# Altium project UHF RFID reder.PrjPcb (part 1 of 2)
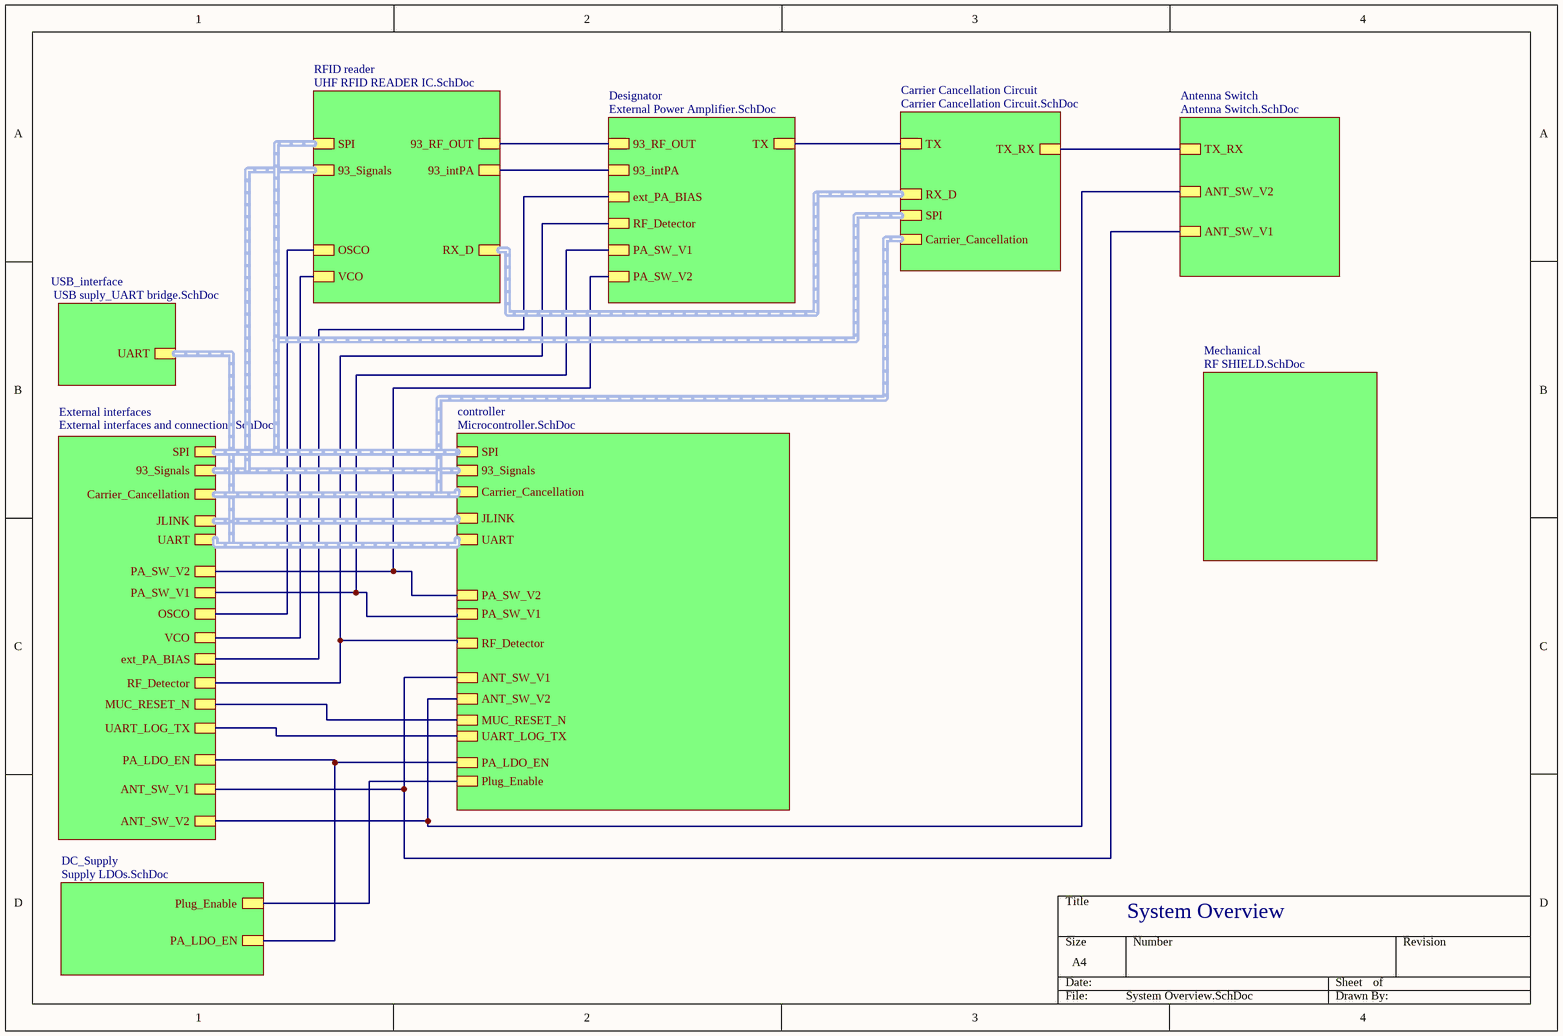
[diagram p0: System Overview.SchDoc]
10 sheets, 305 parts. Net scope: hierarchical (ports join the sheet entries above them; power ports are global).
Board file: UHF_RFID_PROJECT.PcbDoc
Sheets:
  System Overview.SchDoc
    RFID reader = UHF RFID READER IC.SchDoc
    Designator = External Power Amplifier.SchDoc
    Antenna Switch = Antenna Switch.SchDoc
    Carrier Cancellation Circuit = Carrier Cancellation Circuit.SchDoc
    USB_interface = USB suply_UART bridge.SchDoc
    External interfaces = External interfaces and connections.SchDoc
    controller = Microcontroller.SchDoc
    DC_Supply = Supply LDOs.SchDoc
    Mechanical = RF SHIELD.SchDoc

## Sheet System Overview.SchDoc
size A4; SheetNumber: 1; SheetTotal: 10

### Sub-sheets
Antenna Switch = Antenna Switch.SchDoc: TX_RX, ANT_SW_V2, ANT_SW_V1
Carrier Cancellation Circuit = Carrier Cancellation Circuit.SchDoc: TX, TX_RX, RX_D (harness RX_D), SPI (harness SPI), Carrier_Cancellation (harness Carrier_Cancellation)
controller = Microcontroller.SchDoc: JLINK (harness JLINK), UART (harness UART), PA_SW_V2, PA_SW_V1, RF_Detector, ANT_SW_V2, ANT_SW_V1, MUC_RESET_N, PA_LDO_EN, SPI (harness SPI), 93_Signals (harness 93_Signals), Carrier_Cancellation (harness Carrier_Cancellation), UART_LOG_TX, Plug_Enable
DC_Supply = Supply LDOs.SchDoc: Plug_Enable, PA_LDO_EN
Designator = External Power Amplifier.SchDoc: TX, 93_RF_OUT, 93_intPA, ext_PA_BIAS, RF_Detector, PA_SW_V1, PA_SW_V2
External interfaces = External interfaces and connections.SchDoc: PA_SW_V2, PA_SW_V1, OSCO, VCO, ext_PA_BIAS, RF_Detector, MUC_RESET_N, UART_LOG_TX, PA_LDO_EN, ANT_SW_V1, ANT_SW_V2, SPI (harness SPI), 93_Signals (harness 93_Signals), Carrier_Cancellation (harness Carrier_Cancellation), JLINK (harness JLINK), UART (harness UART)
Mechanical = RF SHIELD.SchDoc: no entries
RFID reader = UHF RFID READER IC.SchDoc: 93_RF_OUT, OSCO, VCO, 93_intPA, SPI (harness SPI), 93_Signals (harness 93_Signals), RX_D (harness RX_D)
USB_interface = USB suply_UART bridge.SchDoc: UART (harness UART)

### Nets
Detector: sheet Designator/RF_Detector, sheet External interfaces/RF_Detector, sheet controller/RF_Detector
OSCO: sheet RFID reader/OSCO, sheet External interfaces/OSCO
PA_LDO_EN: sheet External interfaces/PA_LDO_EN, sheet controller/PA_LDO_EN, sheet DC_Supply/PA_LDO_EN
UART_LOG_TX: sheet External interfaces/UART_LOG_TX, sheet controller/UART_LOG_TX
NetB1_1: sheet External interfaces/MUC_RESET_N, sheet controller/MUC_RESET_N
NetC55_2: sheet RFID reader/VCO, sheet External interfaces/VCO
NetC107_2: sheet RFID reader/93_intPA, sheet Designator/93_intPA
NetC112_2: sheet Antenna Switch/TX_RX, sheet Carrier Cancellation Circuit/TX_RX
NetJ1_A: sheet RFID reader/93_RF_OUT, sheet Designator/93_RF_OUT
NetJ14_3: sheet controller/Plug_Enable, sheet DC_Supply/Plug_Enable
NetJ30_1: sheet Designator/PA_SW_V1, sheet External interfaces/PA_SW_V1, sheet controller/PA_SW_V1
NetJ30_2: sheet Designator/PA_SW_V2, sheet External interfaces/PA_SW_V2, sheet controller/PA_SW_V2
NetJ31_1: sheet Antenna Switch/ANT_SW_V1, sheet External interfaces/ANT_SW_V1, sheet controller/ANT_SW_V1
NetJ31_2: sheet Antenna Switch/ANT_SW_V2, sheet External interfaces/ANT_SW_V2, sheet controller/ANT_SW_V2
NetR21_2: sheet Designator/ext_PA_BIAS, sheet External interfaces/ext_PA_BIAS
NetT2_1: sheet Designator/TX, sheet Carrier Cancellation Circuit/TX

### Buses and harness runs
harness sheet Carrier Cancellation Circuit/Carrier_Cancellation = sheet controller/Carrier_Cancellation = sheet External interfaces/Carrier_Cancellation
harness sheet Carrier Cancellation Circuit/RX_D = sheet RFID reader/RX_D
harness sheet Carrier Cancellation Circuit/SPI = sheet controller/SPI = sheet External interfaces/SPI = sheet RFID reader/SPI
harness sheet controller/93_Signals = sheet External interfaces/93_Signals = sheet RFID reader/93_Signals
harness sheet controller/JLINK = sheet External interfaces/JLINK
harness sheet controller/UART = sheet External interfaces/UART = sheet USB_interface/UART

### Notes on the sheet
- System Overview

## Sheet UHF RFID READER IC.SchDoc
size A4; SheetNumber: 2; SheetTotal: 10
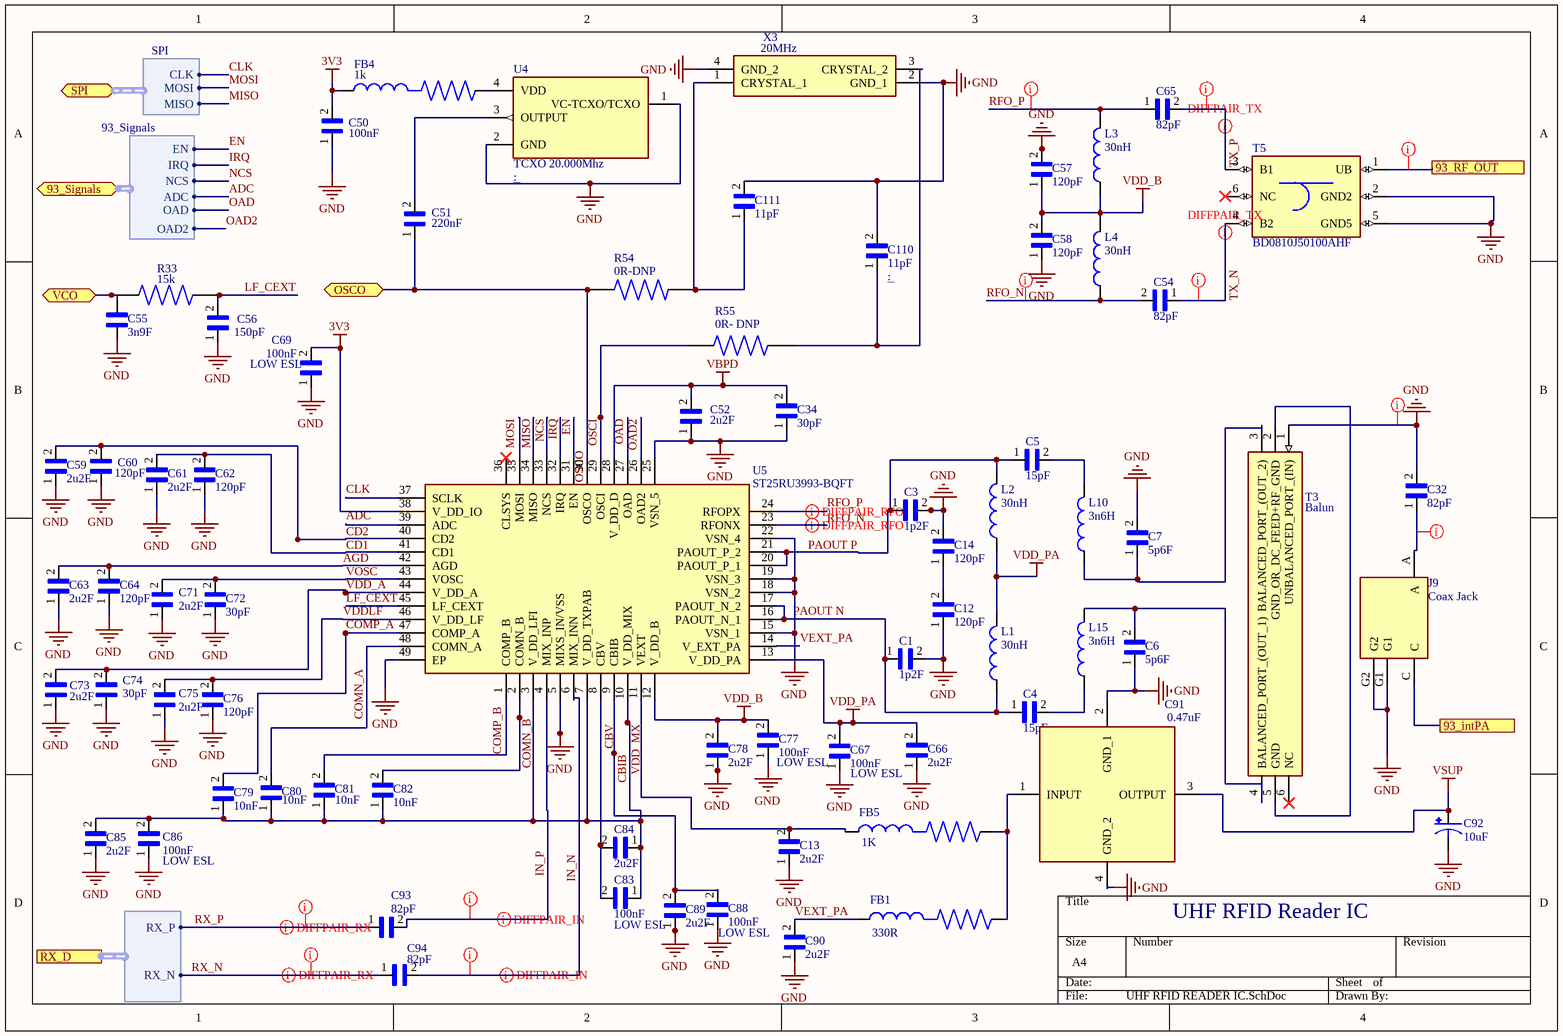
[diagram p1: UHF RFID READER IC.SchDoc]

### Parts
C1  1p2F  [CAPC1005X55N]
C3  1p2F  [CAPC1005X55N]
C4  15pF  [CAPC1005X55N]
C5  15pF  [CAPC1005X55N]
C6  5p6F  [CAPC1005X55N]
C7  5p6F  [CAPC1005X55N]
C12  120pF  [CAPC0603X33N]
C13  2u2F  [CAPC0603X35N]
C14  120pF  [CAPC0603X33N]
C32  82pF  [CAPC1005X55N]
C34  30pF  [CAPC0603X33N]
C50  100nF  [CAPC1005X55N]
C51  220nF  [CAPC1005X55N]
C52  2u2F  [CAPC0603X35N]
C54  82pF  [CAPC1005X55N]
C55  3n9F  [CAPC1005X55N]
C56  150pF  [CAPC1005X55N]
C57  120pF  [CAPC0603X33N]
C58  120pF  [CAPC0603X33N]
C59  2u2F  [CAPC0603X35N]
C60  120pF  [CAPC0603X33N]
C61  2u2F  [CAPC0603X35N]
C62  120pF  [CAPC0603X33N]
C63  2u2F  [CAPC0603X35N]
C64  120pF  [CAPC0603X33N]
C65  82pF  [CAPC1005X55N]
C66  2u2F  [CAPC0603X35N]
C67  100nF  [CAPC0510X35N]
C69  100nF  [CAPC0510X35N]
C71  2u2F  [CAPC0603X35N]
C72  30pF  [CAPC0603X33N]
C73  2u2F  [CAPC0603X35N]
C74  30pF  [CAPC0603X33N]
C75  2u2F  [CAPC0603X35N]
C76  120pF  [CAPC0603X33N]
C77  100nF  [CAPC0510X35N]
C78  2u2F  [CAPC0603X35N]
C79  10nF  [CAPC0603X33N]
C80  10nF  [CAPC0603X33N]
C81  10nF  [CAPC0603X33N]
C82  10nF  [CAPC0603X33N]
C83  100nF  [CAPC0510X35N]
C84  2u2F  [CAPC0603X35N]
C85  2u2F  [CAPC0603X35N]
C86  100nF  [CAPC0510X35N]
C88  100nF  [CAPC0510X35N]
C89  2u2F  [CAPC0603X35N]
C90  2u2F  [CAPC0603X35N]
C91  0.47uF  [NFM18CC101R1C3D]
C92  10uF  [2917(POL)]
C93  82pF  [CAPC1005X55N]
C94  82pF  [CAPC1005X55N]
C110  11pF  [CAPC1005X55N]
C111  11pF  [CAPC1005X55N]
FB1  330R  [BEADC1005X55N]
FB4  1k  [BEADC1005X55N]
FB5  1K  [BEADC1005X55N]
J9  Coax Jack  [SW_MS-156HF(01)]
L1  30nH  [INDC1005X60N]
L2  30nH  [INDC1005X60N]
L3  30nH  [INDC1005X60N]
L4  30nH  [INDC1005X60N]
L10  3n6H  [INDC1006X60N]
L15  3n6H  [INDC1006X60N]
R33  15k  [RES_ERJ-2GEJ153X]
R54  0R-DNP  [RESC1607X60N]
R55  0R- DNP  [RESC1607X60N]
T3  Balun  [0900BL15C050E]
T5  BD0810J50100AHF  [BD0810J50100AHF]
U4  TCXO 20.000Mhz  [OSCCC320X250X100N]
U5  ST25RU3993-BQFT  [FP-ST25RU3993-BQFT-IPC_A]
X3  20MHz  [NX3225SA20000000MHZB2]

### Ports
93_intPA (see System Overview[2A], External Power Amplifier[3A]), 93_RF_OUT (see System Overview[2A], External Power Amplifier[1B]), 93_Signals (bidir, harness 93_Signals, see System Overview[1A], External interfaces and connections[1B], Microcontroller[4A]), OSCO (bidir, see System Overview[1A], External interfaces and connections[4C]), RX_D (harness RX_D, see System Overview[2A], Carrier Cancellation Circuit[3B]), SPI (bidir, harness SPI, see System Overview[1A], Carrier Cancellation Circuit[1A], External interfaces and connections[1A], Microcontroller[4A]), VCO (bidir, see System Overview[1B], External interfaces and connections[4C])

### Harnesses
SPI: CLK, MISO, MOSI
93_Signals: EN, IRQ, NCS, ADC, OAD, OAD2
RX_D: RX_P, RX_N

### Nets
3V3: C50.2 C69.2 FB4.1 U5.38(V_DD_IO)
GND: C1.2 C3.2 C6.1 C7.2 C12.1 C13.1 C14.2 C32.2 C34.1 C50.1 C52.1 C55.1 C56.1 C57.2 C58.1 C59.1 C60.1 C61.1 C62.1 C63.1 C64.1 C66.1 C67.1 C69.1 C71.1 C72.1 C73.1 C74.1 C75.1 C76.1 C77.1 C78.1 C85.1 C86.1 C88.1 C89.1 C90.1 C91.2(GND_1) C91.4(GND_2) C92.2(NEG) C110.2 C111.2 J9.G1 J9.G2 T3.1(UNBALANCED_PORT_(IN)) T5.2(GND2) T5.5(GND5) U4.1(VC-TCXO/TCXO) U4.2(GND) U5.5(MIXS_IN/VSS) U5.15(VSN_1) U5.18(VSN_2) U5.19(VSN_3) U5.22(VSN_4) U5.25(VSN_5) U5.49(EP) X3.2(GND_1) X3.4(GND_2)
VBPD: C34.2 C52.2 U5.28(V_DD_D)
VDD_B: C57.1 C58.2 C77.2 C78.2 L3.1 L4.2 U5.12(V_DD_B)
VDD_PA: C66.2 C67.2 L1.2 L2.1 U5.13(V_DD_PA)
VSUP: C91.3(OUTPUT) C92.1(POS)
ADC: U5.39(ADC) ; port 93_Signals.ADC
AGD: C63.2 C64.2 U5.42(AGD)
CBIB: C88.2 C89.2 U5.9(CBIB)
CBV: C83.2 C84.2 U5.8(CBV)
CD1: C61.2 C62.2 U5.41(CD1)
CD2: C59.2 C60.2 U5.40(CD2)
CLK: U5.37(SCLK) ; port SPI.CLK
COMN_A: C80.2 U5.48(COMN_A)
COMN_B: C82.2 U5.2(COMN_B)
COMP_A: C79.2 U5.47(COMP_A)
COMP_B: C81.2 U5.1(COMP_B)
EN: U5.31(EN) ; port 93_Signals.EN
IN_N: C94.2 U5.6(MIX_INN)
IN_P: C93.2 U5.4(MIX_INP)
IRQ: U5.32(IRQ) ; port 93_Signals.IRQ
LF_CEXT: C56.2 R33.2 U5.45(LF_CEXT)
MISO: U5.34(MISO) ; port SPI.MISO
MOSI: U5.35(MOSI) ; port SPI.MOSI
NCS: U5.33(NCS) ; port 93_Signals.NCS
OAD: U5.27(OAD) ; port 93_Signals.OAD
OAD2: U5.26(OAD2) ; port 93_Signals.OAD2
OSCI: R55.1 U5.29(OSCI)
OSCO: C51.1 R54.1 U5.30(OSCO) ; port OSCO
PAOUT N: C1.1 C4.1 L1.1 U5.16(PAOUT_N_1) U5.17(PAOUT_N_2)
PAOUT P: C3.1 C5.1 L2.2 U5.20(PAOUT_P_1) U5.21(PAOUT_P_2)
RFO_N: C54.2 L4.1 U5.23(RFONX)
RFO_P: C65.1 L3.2 U5.24(RFOPX)
RX_N: C94.1 ; port RX_D.RX_N
RX_P: C93.1 ; port RX_D.RX_P
TX_N: C54.1 T5.4(B2)
TX_P: C65.2 T5.3(B1)
VDD_A: C73.2 C74.2 U5.44(V_DD_A)
VDD_MX: C79.1 C80.1 C81.1 C82.1 C83.1 C84.1 C85.2 C86.2 U5.3(V_DD_LFI) U5.7(V_DD_TXPAB) U5.10(V_DD_MIX)
VDDLF: C75.2 C76.2 U5.46(V_DD_LF)
VEXT_PA: C90.2 FB1.1 U5.14(V_EXT_PA)
VOSC: C71.2 C72.2 U5.43(VOSC)
NetC4_2: C4.2 L15.1
NetC5_2: C5.2 L10.2
NetC6_2: C6.2 L15.2 T3.4(BALANCED_PORT_(OUT_1))
NetC7_1: C7.1 L10.1 T3.3(BALANCED_PORT_(OUT_2))
NetC12_2: C12.2 C14.1
NetC13_2: C13.2 FB5.1 U5.11(VEXT)
NetC32_1: C32.1 J9.A
NetC51_2: C51.2 U4.3(OUTPUT)
NetC55_2: C55.2 R33.1 ; port VCO
NetC91_1: C91.1(INPUT) FB1.2 FB5.2
NetC107_2: J9.C ; port 93_intPA
NetC110_1: C110.1 R55.2 X3.3(CRYSTAL_2)
NetC111_1: C111.1 R54.2 X3.1(CRYSTAL_1)
NetFB4_2: FB4.2 U4.4(VDD)
NetJ1_A: T5.1(UB) ; port 93_RF_OUT
NetT3_2: T3.2(GND_OR_DC_FEED+RF_GND) T3.5(GND)

Not connected (* = marked no-connect by the designer): T3 6(NC)*; T5 6(NC)*; U5 36(CLSYS)*

### Layout directives
differential pair; differential pair class RFO: RFO_N, RFO_P
differential pair; differential pair class TX: TX_N, TX_P
differential pair; differential pair class RX: RX_N, RX_P
differential pair; differential pair class IN: IN_N, IN_P
net class RF_100: IN_N, IN_P, RFO_N, RFO_P, RX_N, RX_P, TX_N, TX_P
net class RF_50: GND, NetC32_1, NetJ1_A

### Notes on the sheet
- (near C69) LOW ESL
- LOW ESL
- (near C67) LOW ESL
- (near C86) LOW ESL
- (near C91) UHF RFID Reader IC
- (near C88) LOW ESL

### Library data of the parts
C1 C3 = GRM1555C1H1R2WA01D: SMD Capacitor C0G_EIA_ with Capacitance: 1.2pF Tol. 0.05pF. Rated Voltage: 50Vdc; MF: Murata Electronics; MP: GRM1555C1H1R2WA01D; Availability: Unavailable; Package: 1005 Taiyo Yuden; Value: *; Price: None; SnapEDA_Link: https://www.snapeda.com/parts/GRM1555C1H1R2WA01D/Murata%20Electronics%20North%20America/view-part/1837628/?ref=snap
C4 C5 = GRM1555C1H150GA01D: 0402 15 pF 50 V Â±2% Tolerance C0G SMT Multilayer Ceramic Capacitor; Package: None; Price: None; Value: *; MP: GRM1555C1H150GA01D; Availability: Unavailable
C6 C7 = GJM1555C1H5R6CB01D: SMD Capacitor C0G(EIA) with Capacitance: 5.6pF Tol. 0.25pF. Rated Voltage: 50Vdc; MF: Murata; Purchase-URL: https://pricing.snapeda.com/search/part/GJM1555C1H5R6CB01D/?ref=eda; SnapEDA_Link: https://www.snapeda.com/parts/GJM1555C1H5R6CB01D/Murata/view-part/4376987/?ref=snap; Value: *; MP: GJM1555C1H5R6CB01D; Check_prices: https://www.snapeda.com/parts/GJM1555C1H5R6CB01D/Murata/view-part/4376987/?ref=eda; Package: 1005 Taiyo Yuden; Availability: Good; Price: None
C12 C14 C57 C58 C60 C62 C64 C76 = GRM0335C1H121JA01D: 0201 120 pF 50 V Â±5% Tolerance C0G SMT Multilayer Ceramic Capacitor; MF: Murata Electronics; Check_prices: https://www.snapeda.com/parts/GRM0335C1H121JA01D/Murata%20Electronics%20North%20America/view-part/1767262/?ref=eda; Value: *; Purchase-URL: https://pricing.snapeda.com/search/part/GRM0335C1H121JA01D/?ref=eda; Package: 0603 Taiyo Yuden; Price: None; MP: GRM0335C1H121JA01D; Availability: In Stock; SnapEDA_Link: https://www.snapeda.com/parts/GRM0335C1H121JA01D/Murata%20Electronics%20North%20America/view-part/1767262/?ref=snap
C13 C52 C59 C61 C63 C66 C71 C73 C75 C78 C84 C85 C89 C90 = GRM033R60J225ME15D: SMD Capacitor X5R(EIA) with Capacitance: 2.2uF Tol. 20%. Rated Voltage: 6.3Vdc; Package: None; Price: None; Value: *; MP: GRM033R60J225ME15D; Availability: Unavailable
C32 C54 C65 C93 C94 = GRM1555C1H820GA01J: CAP CER 82PF 50V C0G/NP0 0402; Package: None; Price: None; Value: *; MP: GRM1555C1H820GA01J; Availability: Unavailable
C34 C72 C74 = GRM0335C1H300GA01D: SMD Capacitor C0G(EIA) with Capacitance: 30pF Tol. 2%. Rated Voltage: 50Vdc; Package: None; Price: None; Value: *; MP: GRM0335C1H300GA01D; Availability: Unavailable
C50 = GRM155R71C104KA88D: SMD Capacitor X7R_EIA_ with Capacitance: 0.10uF Tol. 10%. Rated Voltage: 16Vdc; MF: Murata; Package: 1005 Taiyo Yuden; Value: *; MP: GRM155R71C104KA88D; SnapEDA_Link: https://www.snapeda.com/parts/GRM155R71C104KA88D/Murata%20Electronics%20North%20America/view-part/4750/?ref=snap
C51 = GRM155R6YA224KE01D: CAP CER 0.22UF 35V X5R 0402; Package: None; Price: None; Value: *; MP: GRM155R6YA224KE01D; Availability: Unavailable
C55 = GRM1557U1A392JA01D: 0402 10 V 3900 pF ±5% Tolerance U2J Monolithic Ceramic Chip Capacitor; MF: Murata; SnapEDA_Link: https://www.snapeda.com/parts/GRM1557U1A392JA01D/Murata+Electronics+North+America/view-part/?ref=snap; Package: 1005 Taiyo Yuden; Value: *; MP: GRM1557U1A392JA01D; Check_prices: https://www.snapeda.com/parts/GRM1557U1A392JA01D/Murata+Electronics+North+America/view-part/?ref=eda
C56 = GRM1555C1H151FA01D: Cap Ceramic 150pF 50V C0G 1% SMD 0402 125Â°C Paper T/R; Package: None; Price: None; Value: *; MP: GRM1555C1H151FA01D; Availability: Unavailable
C67 C69 C77 C83 C86 C88 = LLL153C80J104ME01E: SMD Capacitor X6S(EIA) with Capacitance: 0.10uF Tol. 20%. Rated Voltage: 6.3Vdc; MF: Murata; Price: None; Value: *; Purchase-URL: https://pricing.snapeda.com/search/part/LLL153C80J104ME01E/?ref=eda; Package: 0510 Murata; SnapEDA_Link: https://www.snapeda.com/parts/LLL153C80J104ME01E/Murata/view-part/4376162/?ref=snap; Availability: Good; MP: LLL153C80J104ME01E
C79-C82 = GRM033R71A103KA01D: SMD Capacitor X7R(EIA) with Capacitance: 10000pF Tol. 10%. Rated Voltage: 10Vdc; MF: Murata; MP: GRM033R71A103KA01D; Availability: Unavailable; SnapEDA_Link: https://www.snapeda.com/parts/GRM033R71A103KA01D/Murata/view-part/4379446/?ref=snap; Value: *; Check_prices: https://www.snapeda.com/parts/GRM033R71A103KA01D/Murata/view-part/4379446/?ref=eda; Package: 0603 Taiyo Yuden; Price: None
C91 = NFM18PS474R0J3D: Capacitor; Manufacturer_Name: Murata Electronics; Datasheet Link: https://psearch.en.murata.com/capacitor/product/NFM18PS474R0J3%23.html; Height: 0.7mm; Manufacturer_Part_Number: NFM18PS474R0J3D; Mouser Part Number: 81-NFM18PS474R0J3D; Mouser Price/Stock: https://www.mouser.co.uk/ProductDetail/Murata-Electronics/NFM18PS474R0J3D?qs=OWtbBJ4e7yHgIGJxSdBqtA%3D%3D; Arrow Part Number: NFM18PS474R0J3D; Arrow Price/Stock: https://www.arrow.com/en/products/nfm18ps474r0j3d/murata-manufacturing?region=nac
C92 = ECASD41C106M060K00: 10 ÂµF 16 V Aluminum - Polymer Capacitors 2917 (7343 Metric) 60mOhm 1000 Hrs @ 105Â°C; MF: Murata Electronics; SnapEDA_Link: https://www.snapeda.com/parts/ECASD41C106M060K00/Murata+Electronics+North+America/view-part/?ref=snap; Package: 2917 Murata; Value: *; MP: ECASD41C106M060K00; Check_prices: https://www.snapeda.com/parts/ECASD41C106M060K00/Murata+Electronics+North+America/view-part/?ref=eda
C110 C111 = GJM1555C1H110GB01D: SMD Capacitor C0G(EIA) with Capacitance: 11pF Tol. 2%. Rated Voltage: 50Vdc; MF: Murata; MP: GJM1555C1H110GB01D; Package: 1005 Taiyo Yuden; Purchase-URL: https://pricing.snapeda.com/search/part/GJM1555C1H110GB01D/?ref=eda; Digi-Key_Part_Number: 490-6072-1-ND; SnapEDA_Link: https://www.snapeda.com/parts/GJM1555C1H110GB01D/Murata/view-part/4385613/?ref=snap; Value: *
FB1 = BLM15PX331SN1D: 330 Ohms @ 100MHz 1 Power Line Ferrite Bead 0402 (1005 Metric) 1.2A 150mOhm; MF: Murata Electronics; SnapEDA_Link: https://www.snapeda.com/parts/BLM15PX331SN1D/Murata/view-part/2723257/?ref=snap; Availability: Good; MP: BLM15PX331SN1D; Package: 1005 Taiyo Yuden; Price: None; Purchase-URL: https://pricing.snapeda.com/search/part/BLM15PX331SN1D/?ref=eda; Value: *
FB4 FB5 = BLM15HG102SN1D: 1 kOhms @ 100MHz 1 Signal Line Ferrite Bead 0402 _1005 Metric_ 250mA 1.1Ohm; MF: Murata; Value: *; SnapEDA_Link: https://www.snapeda.com/parts/BLM15HG102SN1D/Murata/view-part/270056/?ref=snap; Digi-Key_Part_Number: 490-3999-1-ND; Digi-Key_Purchase_URL: https://www.digikey.com/product-detail/en/murata-electronics/BLM15HG102SN1D/490-3999-1-ND/1016259?utm_source=snapeda&utm_medium=aggregator&utm_campaign=symbol; Package: 1005 Taiyo Yuden; MP: BLM15HG102SN1D
J9 = MS-156HF(01): Coaxial Switch - 4mm Plug Dia Connector Receptacle, Female Socket 50Ohm Surface Mount Solder; MF: Hirose Electric; Package: None; MP: MS-156HF(01); Value: *; SnapEDA_Link: https://www.snapeda.com/parts/MS-156HF(01)/Hirose%20Electric%20Co%20Ltd/view-part/1243878/?ref=snap; Price: None; Availability: Unavailable
L1-L4 = LQW15AN30NG00D: Inductor with Inductance: 30nH Tol. +/-2%, Package: 0402 (1005); MF: Murata; SnapEDA_Link: https://www.snapeda.com/parts/LQW15AN30NG00D/Murata%20Electronics%20North%20America/view-part/1502539/?ref=snap; MP: LQW15AN30NG00D; DigiKey-Purchase-URL: https://snapeda.com/shop?store=DigiKey&id=1502539; Package: 1005 Murata; Value: *; Digi-Key_Part_Number: 490-6802-1-ND
L10 L15 = LQW15AN3N6C10D: FIXED IND 3.6NH 900MA 40 MOHM; Package: None; Price: None; Value: *; MP: LQW15AN3N6C10D; Availability: Unavailable
R33 = ERJ-2GEJ153X: 15 kOhms ±5% 0.1W, 1/10W Chip Resistor 0402 (1005 Metric) Automotive AEC-Q200 Thick Film; MF: Panasonic Electronic; SnapEDA_Link: https://www.snapeda.com/parts/ERJ-2GEJ153X/Panasonic+Electronic+Components/view-part/?ref=snap; Package: 1020-2 Panasonic; Value: *; MP: ERJ-2GEJ153X; Check_prices: https://www.snapeda.com/parts/ERJ-2GEJ153X/Panasonic+Electronic+Components/view-part/?ref=eda
R54 R55 = RC0603JR-070RL: Thick film general purpose; Availability: Unavailable; Package: None; MP: RC0603JR-070RL; Value: *; Price: None
T3 = 0900BL15C050E: Filter; Manufacturer_Name: JOHANSON TECHNOLOGY; Datasheet Link: https://www.johansontechnology.com/datasheets/0900BL15C050/0900BL15C050.pdf; Height: 0.8mm; Manufacturer_Part_Number: 0900BL15C050E; Mouser Part Number: 609-0900BL15C050E; Mouser Price/Stock: https://www.mouser.co.uk/ProductDetail/Johanson-Technology/0900BL15C050E?qs=yCnrNFeXz%252BjgDEe7ZYwcVg%3D%3D; Arrow Part Number: 0900BL15C050E; Arrow Price/Stock: https://www.arrow.com/en/products/0900bl15c050e/johanson-dielectrics?region=europe
T5 = BD0810J50100AHF: Signal Conditioning 800-1000MHz 50/100 Ohm IL=.95dB; MF: ttm technologies; SnapEDA_Link: https://www.snapeda.com/parts/BD0810J50100AHF/LM+Technologies/view-part/?ref=snap; Package: None; Value: *; MP: BD0810J50100AHF; Check_prices: https://www.snapeda.com/parts/BD0810J50100AHF/LM+Technologies/view-part/?ref=eda
U4 = TXETDCSANF-20.000000: 20MHz TCXO Clipped Sine Wave Oscillator 2.8V ~ 3.3V 4-SMD, No Lead; MF: Taitien; Package: SMD-4 Taitien; SnapEDA_Link: https://www.snapeda.com/parts/TXETDCSANF-20.000000/Taitien/view-part/3601305/?ref=snap; MP: TXETDCSANF-20.000000; Availability: Warning; Price: None; Value: *; Purchase-URL: https://pricing.snapeda.com/search/part/TXETDCSANF-20.000000/?ref=eda
U5 = ST25RU3993-BQFT: Integrated Circuit; Manufacturer_Name: STMicroelectronics; Datasheet Link: https://www.st.com/resource/en/datasheet/st25ru3993.pdf; Height: 1mm; Manufacturer_Part_Number: ST25RU3993-BQFT; Mouser Part Number: 511-ST25RU3993-BQFT; Mouser Price/Stock: https://www.mouser.co.uk/ProductDetail/STMicroelectronics/ST25RU3993-BQFT?qs=VBQ3p0kw5tgG4N%252BXfjyUgw%3D%3D; Arrow Part Number: ST25RU3993-BQFT; Arrow Price/Stock: https://www.arrow.com/en/products/st25ru3993-bqft/stmicroelectronics?region=nac
X3 = NX3225SA-20.000000MHZ-B2: Crystal or Oscillator; Manufacturer_Name: NDK; Datasheet Link: https://media.digikey.com/pdf/Data%20Sheets/NDK%20PDFs/NX3225SA-20.000000MHz-B2.pdf; Height: 0.7mm; Manufacturer_Part_Number: NX3225SA-20.000000MHZ-B2; Mouser Part Number: 344-NX3225SA20MHZB2; Mouser Price/Stock: https://www.mouser.co.uk/ProductDetail/NDK/NX3225SA-20.000000MHZ-B2?qs=w%2Fv1CP2dgqr91JjcOyduEA%3D%3D

## Sheet External Power Amplifier.SchDoc
size A4; SheetNumber: 3; SheetTotal: 10
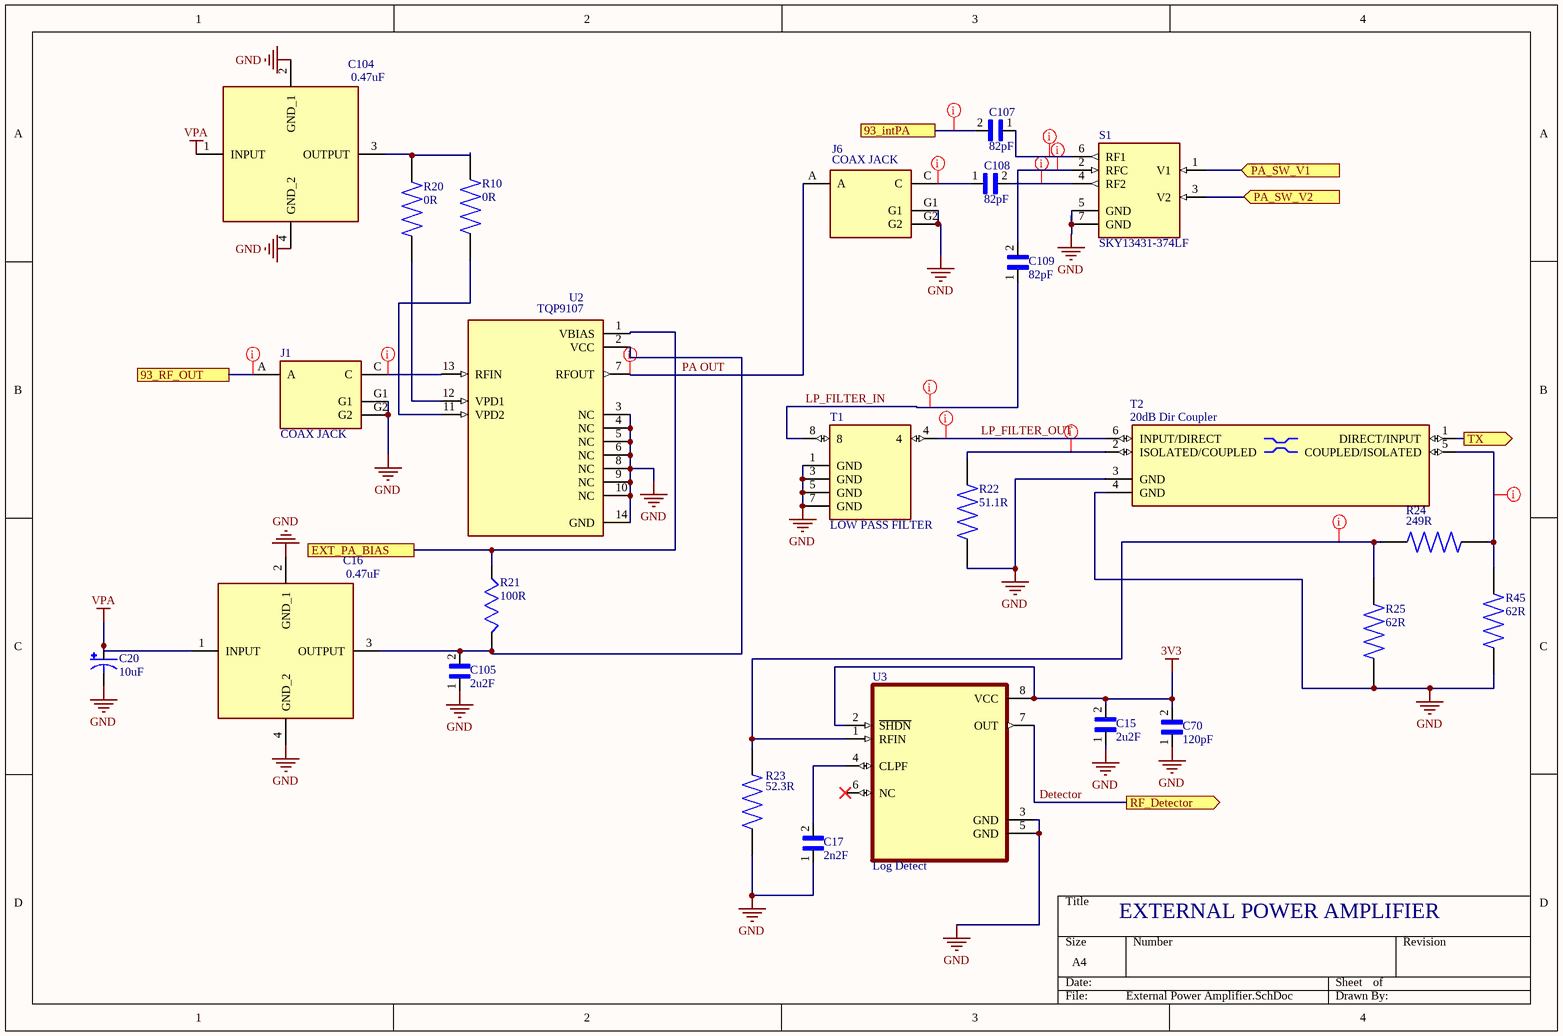
[diagram p2: External Power Amplifier.SchDoc]

### Parts
C15  2u2F  [CAPC0603X35N]
C16  0.47uF  [NFM18CC101R1C3D]
C17  2n2F  [CAPC1005X55N]
C20  10uF  [2917(POL)]
C70  120pF  [CAPC0603X33N]
C104  0.47uF  [NFM18CC101R1C3D]
C105  2u2F  [CAPC0603X35N]
C107  82pF  [CAPC1005X55N]
C108  82pF  [CAPC1005X55N]
C109  82pF  [CAPC1005X55N]
J1  COAX JACK  [SW_MS-156HF(01)]
J6  COAX JACK  [SW_MS-156HF(01)]
R10  0R  [RESC1005X37N]
R20  0R  [RESC1005X37N]
R21  100R  [RESC1005X40]
R22  51.1R  [RESC1005X40N]
R23  52.3R  [RES_ERJ2RKF52R3X]
R24  249R  [RESC1005X40N]
R25  62R  [RESC1005X40N]
R45  62R  [RESC1005X40N]
S1  SKY13431-374LF  [SW_SKY13431-374LF]
T1  LOW PASS FILTER  [FIL_0900LP15B0063E]
T2  20dB Dir Coupler  [COUPLER_DC1722J5020AHF]
U2  TQP9107  [IC_TQP9107]
U3  Log Detect  [SOP65P490X110-8N]

### Ports
93_intPA (see System Overview[2A], UHF RFID READER IC[4C]), 93_RF_OUT (see System Overview[2A], UHF RFID READER IC[4A]), EXT_PA_BIAS (see System Overview[2A], External interfaces and connections[4C]), PA_SW_V1 (in, see System Overview[2A], External interfaces and connections[3C], Microcontroller[1B]), PA_SW_V2 (in, see System Overview[2B], External interfaces and connections[3D], Microcontroller[3A]), RF_Detector (out, see System Overview[2A], External interfaces and connections[4D], Microcontroller[2A]), TX (out, see System Overview[3A], Carrier Cancellation Circuit[1B])

### Nets
3V3: C15.2 C70.2 U3.2(~{SHDN}) U3.8(VCC)
GND: C15.1 C16.2(GND_1) C16.4(GND_2) C17.1 C20.2(NEG) C70.1 C104.2(GND_1) C104.4(GND_2) C105.1 J1.G1 J1.G2 J6.G1 J6.G2 R22.1 R23.1 R25.1 R45.1 S1.5(GND) S1.7(GND) T1.1(GND) T1.3(GND) T1.5(GND) T1.7(GND) T2.3(GND) T2.4(GND) U2.3(NC) U2.4(NC) U2.5(NC) U2.6(NC) U2.8(NC) U2.9(NC) U2.10(NC) U2.14(GND) U3.3(GND) U3.5(GND)
VPA: C16.1(INPUT) C20.1(POS) C104.1(INPUT)
Detector: U3.7(OUT) ; port RF_Detector
LP_FILTER_IN: C109.1 T1.8
LP_FILTER_OUT: T1.4 T2.6(INPUT/DIRECT)
PA OUT: J6.A U2.7(RFOUT)
NetC16_3: C16.3(OUTPUT) C105.2 R21.1 U2.2(VCC)
NetC17_2: C17.2 U3.4(CLPF)
NetC104_3: C104.3(OUTPUT) R10.2 R20.2
NetC107_1: C107.1 S1.6(RF1)
NetC107_2: C107.2 ; port 93_intPA
NetC108_1: C108.1 J6.C
NetC108_2: C108.2 S1.4(RF2)
NetC109_2: C109.2 S1.2(RFC)
NetJ1_A: J1.A ; port 93_RF_OUT
NetJ1_C: J1.C U2.13(RFIN)
NetJ30_1: S1.1(V1) ; port PA_SW_V1
NetJ30_2: S1.3(V2) ; port PA_SW_V2
NetR10_1: R10.1 U2.11(VPD2)
NetR20_1: R20.1 U2.12(VPD1)
NetR21_2: R21.2 U2.1(VBIAS) ; port EXT_PA_BIAS
NetR22_2: R22.2 T2.2(ISOLATED/COUPLED)
NetR23_2: R23.2 R24.1 R25.2 U3.1(RFIN)
NetR24_2: R24.2 R45.2 T2.5(COUPLED/ISOLATED)
NetT2_1: T2.1(DIRECT/INPUT) ; port TX

Not connected (* = marked no-connect by the designer): U3 6(NC)*

### Layout directives
net class RF_50: LP_FILTER_IN, LP_FILTER_OUT, NetC107_1, NetC107_2, NetC108_1, NetC108_2, NetC109_2, NetJ1_A, NetJ1_C, NetR22_2, NetR23_2, NetR24_2, PA OUT

### Notes on the sheet
- EXTERNAL POWER AMPLIFIER

### Library data of the parts
C15 C105 = GRM033R60J225ME15D: as C13 on sheet UHF RFID READER IC; Package: None; Price: None; Value: *; MP: GRM033R60J225ME15D; Availability: Unavailable
C16 C104 = NFM18PS474R0J3D: as C91 on sheet UHF RFID READER IC; Datasheet Link: https://psearch.en.murata.com/capacitor/product/NFM18PS474R0J3%23.html; Height: 0.7mm; Manufacturer_Part_Number: NFM18PS474R0J3D; Mouser Part Number: 81-NFM18PS474R0J3D; Mouser Price/Stock: https://www.mouser.co.uk/ProductDetail/Murata-Electronics/NFM18PS474R0J3D?qs=OWtbBJ4e7yHgIGJxSdBqtA%3D%3D; Arrow Part Number: NFM18PS474R0J3D; Arrow Price/Stock: https://www.arrow.com/en/products/nfm18ps474r0j3d/murata-manufacturing?region=nac
C17 = GRM155R71H222KA01D: SMD capacitor X7R(EIA) with capacitance 2200pF Tol.10%. Rated voltage 50Vdc 125C; MF: Murata; SnapEDA_Link: https://www.snapeda.com/parts/GRM155R71H222KA01D/Murata%20Electronics%20North%20America/view-part/326477/?ref=snap; Package: 1005 Taiyo Yuden; Value: *; MP: GRM155R71H222KA01D; Purchase-URL: https://pricing.snapeda.com/search/part/GRM155R71H222KA01D/?ref=eda; Availability: Good; Price: None
C20 = ECASD41C106M060K00: as C92 on sheet UHF RFID READER IC; SnapEDA_Link: https://www.snapeda.com/parts/ECASD41C106M060K00/Murata+Electronics+North+America/view-part/?ref=snap; Package: 2917 Murata; Value: *; MP: ECASD41C106M060K00; Check_prices: https://www.snapeda.com/parts/ECASD41C106M060K00/Murata+Electronics+North+America/view-part/?ref=eda
C70 = GRM0335C1H121JA01D: as C12 on sheet UHF RFID READER IC; Check_prices: https://www.snapeda.com/parts/GRM0335C1H121JA01D/Murata%20Electronics%20North%20America/view-part/1767262/?ref=eda; Value: *; Purchase-URL: https://pricing.snapeda.com/search/part/GRM0335C1H121JA01D/?ref=eda; Package: 0603 Taiyo Yuden; Price: None; MP: GRM0335C1H121JA01D; Availability: In Stock; SnapEDA_Link: https://www.snapeda.com/parts/GRM0335C1H121JA01D/Murata%20Electronics%20North%20America/view-part/1767262/?ref=snap
C107-C109 = GRM1555C1H820GA01J: CAP CER 82PF 50V C0G/NP0 0402; Package: None; Price: None; Value: *; MP: GRM1555C1H820GA01J; Availability: Unavailable
J1 J6 = MS-156HF(01): as J9 on sheet UHF RFID READER IC; Package: None; MP: MS-156HF(01); Value: *; SnapEDA_Link: https://www.snapeda.com/parts/MS-156HF(01)/Hirose%20Electric%20Co%20Ltd/view-part/1243878/?ref=snap; Price: None; Availability: Unavailable
R10 R20 = RC0402JR-070RL: MF: {'manufacturer': u'YAGEO'}; Package: None; Price: None; Value: *; MP: RC0402JR-070RL; Availability: Unavailable
R21 = RC0402FR-07100RL: 100 Ohms Â±1% 0.063W, 1/16W Chip Resistor 0402 (1005 Metric) Moisture Resistant Thick Film; MF: Yageo; SnapEDA_Link: https://www.snapeda.com/parts/RC0402FR-07100RL/Yageo/view-part/?ref=snap; Package: 0402 Yageo; MP: RC0402FR-07100RL; Check_prices: https://www.snapeda.com/parts/RC0402FR-07100RL/Yageo/view-part/?ref=eda; Purchase-URL: https://pricing.snapeda.com/search/part/RC0402FR-07100RL/?ref=eda; Price: None; Value: *; Availability: In Stock
R22 = RC0402FR-0751R1L: Res Thick Film 0402 51.1 Ohm 1% 1/16W ?100ppm/C Molded SMD SMD Paper T/R; MF: {'manufacturer': u'YAGEO'}; Package: None; Price: None; Value: *; MP: RC0402FR-0751R1L; Availability: Unavailable
R23 = ERJ2RKF52R3X: Availability: Unavailable; Price: None; MP: ERJ2RKF52R3X; Value: *; Package: None
R24 = RC0402FR-07249RL: Res Thick Film 0402 249 Ohm 1% 1/16W ?100ppm/C Molded SMD SMD Paper T/R; Package: None; Price: None; Value: *; MP: RC0402FR-07249RL; Availability: Unavailable
R25 R45 = RC0402FR-0762RL: RESISTOR, 0402 0.063W 1% 62R; Resistance:62ohm; Resistance Tolerance:Â± 1%; Power Rating:63mW; Voltage Rating:50V; Temperature Coefficient:Â± 100ppm/Â°C; Resistor Element Material:Thick Film; Resistor Case Style:0402; Resistor Mounting:SMD; SVHC:No SVHC (19-Dec-2011); External Depth:0.35mm; External Length / Height:1mm; External Width:0.5mm; No. of Pins:2; Operating Temperature Range:-55Â°C to +155Â°C; Overload Voltage:100V; Package / Case:0402; Series:RC32H; Temperature Coeff. +:100ppm/Â°C; Temperature Coeff. -:100ppm/Â°C; Package: None; Price: None; Value: *; MP: RC0402FR-0762RL; Availability: Unavailable
S1 = SKY13431-374LF: RF Switch IC WiMax, WLAN SPDT 6GHz 50Ohm 6-DFN (1.5x1.5); MF: Skyworks Solutions; Package: XFDFN-6 Skyworks Solutions; MP: SKY13431-374LF; Purchase-URL: https://pricing.snapeda.com/search/part/SKY13431-374LF/?ref=eda; Value: *; SnapEDA_Link: https://www.snapeda.com/parts/SKY13431-374LF/Skyworks%20Solutions%20Inc./view-part/1233094/?ref=snap; Availability: Warning; Price: None
T1 = 0900LP15B0063E: 911.5MHz Frequency Low Pass RF Filter (Radio Frequency) 97MHz Bandwidth 0.9dB 0805 (2012 Metric), 8 PC Pad; MF: Johanson Technology; MP: 0900LP15B0063E; Value: *; Package: 0805 Johanson; Price: None; Availability: Bad; SnapEDA_Link: https://www.snapeda.com/parts/0900LP15B0063E/Johanson%20Technology%20Inc./view-part/2720562/?ref=snap
T2 = DC1722J5020AHF: RF Directional Coupler General Purpose 1.7GHz ~ 2.2GHz 19.9dB 2W 0805 (2012 Metric); MF: Anaren; MP: DC1722J5020AHF; Package: 0805 Anaren Microwave; Price: None; Availability: Unavailable; SnapEDA_Link: https://www.snapeda.com/parts/DC1722J5020AHF/Anaren/view-part/480148/?ref=snap; Value: *
U2 = TQP9107: RF Amplifier 699-960MHz PAE 31% Gain 35.5dB; MF: Qorvo; Package: None; Availability: Warning; Value: *; MP: TQP9107; SnapEDA_Link: https://www.snapeda.com/parts/TQP9107/Qorvo/view-part/1064589/?ref=snap; Price: None; Purchase-URL: https://pricing.snapeda.com/search/part/TQP9107/?ref=eda
U3 = MAX4003EUA+T: 100MHz to 2500MHz, 45dB RF Detector in a UCSP; MF: Analog Devices; SnapEDA_Link: https://www.snapeda.com/parts/MAX4003EUA+T/Analog+Devices/view-part/?ref=snap; Package: MICRO MAX-8 Maxim; Value: *; MP: MAX4003EUA+T; Check_prices: https://www.snapeda.com/parts/MAX4003EUA+T/Analog+Devices/view-part/?ref=eda

## Sheet Antenna Switch.SchDoc
size A4; SheetNumber: 5; SheetTotal: 10
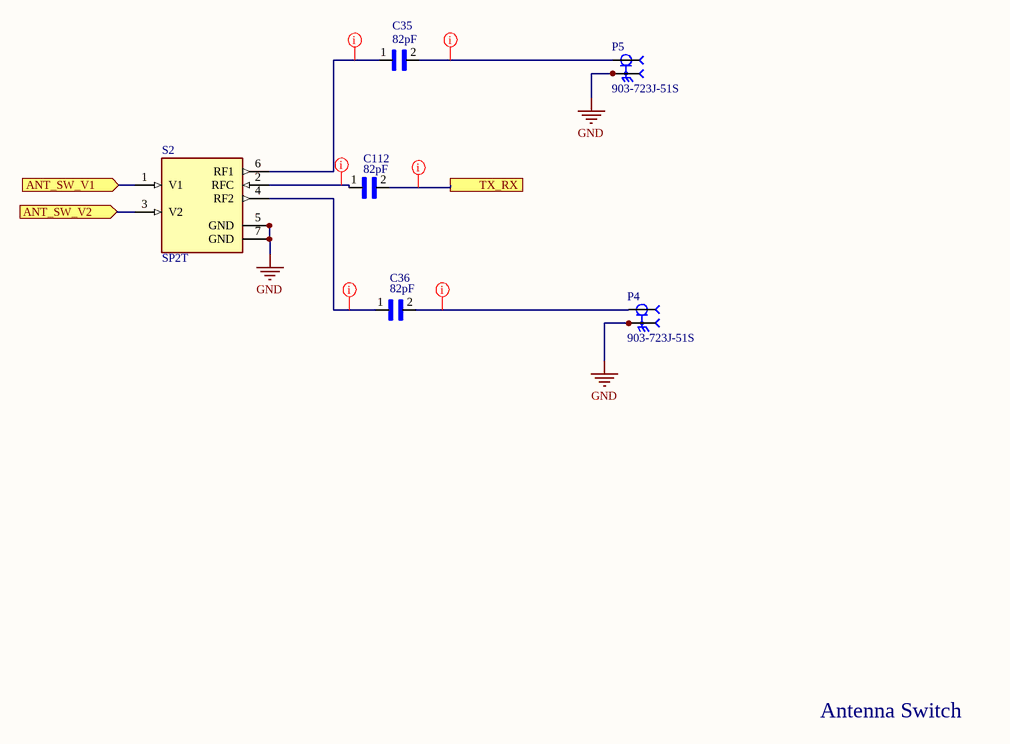
[diagram p3: Antenna Switch.SchDoc]

### Parts
C35  82pF  [CAPC1005X55N]
C36  82pF  [CAPC1005X55N]
C112  82pF  [CAPC1005X55N]
P4  903-723J-51S  [AMPHENOL_903-723J-51S]
P5  903-723J-51S  [AMPHENOL_903-723J-51S]
S2  SP2T  [SW_SKY13431-374LF]

### Ports
ANT_SW_V1 (in, see System Overview[4A], External interfaces and connections[3D], Microcontroller[1C]), ANT_SW_V2 (in, see System Overview[4A], External interfaces and connections[3D], Microcontroller[1C]), TX_RX (see System Overview[4A], Carrier Cancellation Circuit[1B])

### Nets
GND: P4.S1(SHIELD) P4.S2(SHIELD) P4.S3(SHIELD) P4.S4(SHIELD) P4.S5(SHIELD) P4.S6(SHIELD) P4.S7(SHIELD) P4.S8(SHIELD) P5.S1(SHIELD) P5.S2(SHIELD) P5.S3(SHIELD) P5.S4(SHIELD) P5.S5(SHIELD) P5.S6(SHIELD) P5.S7(SHIELD) P5.S8(SHIELD) S2.5(GND) S2.7(GND)
NetC35_1: C35.1 S2.6(RF1)
NetC35_2: C35.2 P5.1(SIG)
NetC36_1: C36.1 S2.4(RF2)
NetC36_2: C36.2 P4.1(SIG)
NetC112_1: C112.1 S2.2(RFC)
NetC112_2: C112.2 ; port TX_RX
NetJ31_1: S2.1(V1) ; port ANT_SW_V1
NetJ31_2: S2.3(V2) ; port ANT_SW_V2

### Layout directives
net class RF_50: NetC35_1, NetC35_2, NetC36_1, NetC36_2, NetC112_1, NetC112_2

### Notes on the sheet
- Antenna Switch

### Library data of the parts
C35 C36 C112 = GRM1555C1H820GA01J: CAP CER 82PF 50V C0G/NP0 0402; Package: None; Price: None; Value: *; MP: GRM1555C1H820GA01J; Availability: Unavailable
P4 P5 = 903-723J-51S: SMB Connector Jack, Male Pin 50Ohm Board Edge, End Launch Solder; Package: None; Price: None; Value: *; MP: 903-723J-51S; Availability: Unavailable
S2 = SKY13431-374LF: as S1 on sheet External Power Amplifier; Package: XFDFN-6 Skyworks Solutions; MP: SKY13431-374LF; Purchase-URL: https://pricing.snapeda.com/search/part/SKY13431-374LF/?ref=eda; Value: *; SnapEDA_Link: https://www.snapeda.com/parts/SKY13431-374LF/Skyworks%20Solutions%20Inc./view-part/1233094/?ref=snap; Availability: Warning; Price: None

## Sheet Carrier Cancellation Circuit.SchDoc
size A4; SheetNumber: 4; SheetTotal: 10
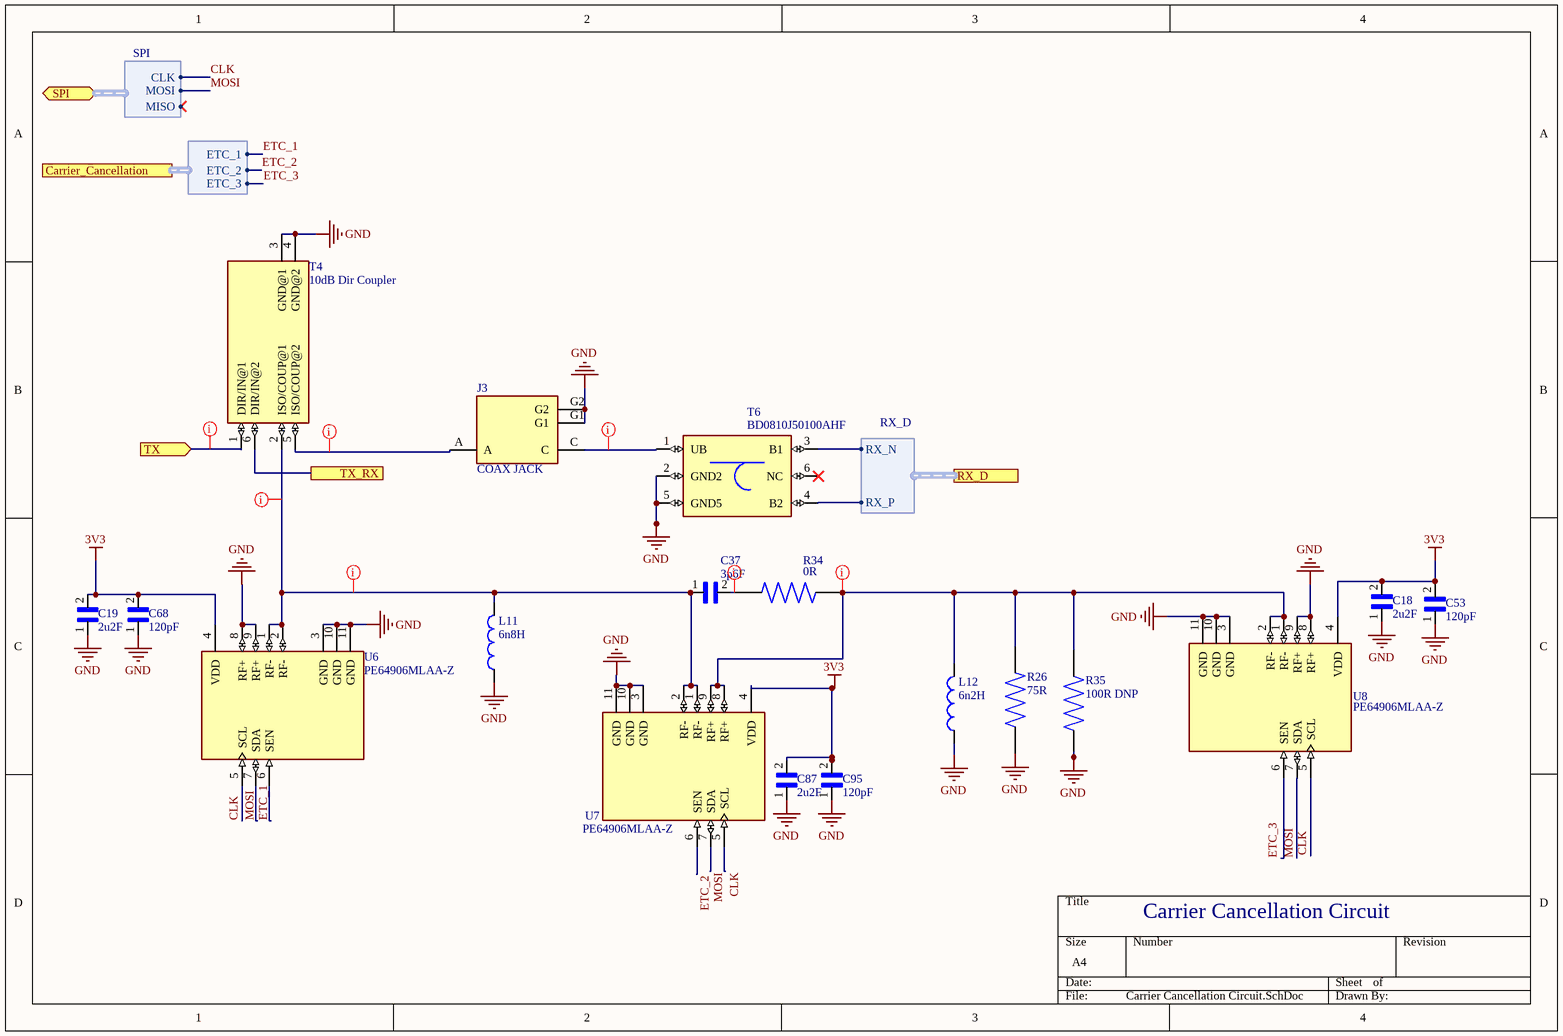
[diagram p4: Carrier Cancellation Circuit.SchDoc]

### Parts
C18  2u2F  [CAPC0603X35N]
C19  2u2F  [CAPC0603X35N]
C37  3p6F  [CAPC1005X55N]
C53  120pF  [CAPC0603X33N]
C68  120pF  [CAPC0603X33N]
C87  2u2F  [CAPC0603X35N]
C95  120pF  [CAPC0603X33N]
J3  COAX JACK  [SW_MS-156HF(01)]
L11  6n8H  [INDC1006X60N]
L12  6n2H  [INDC1006X60N]
R26  75R  [RES_ERJ2RKF75R0X]
R34  0R  [RESC1005X37N]
R35  100R DNP  [RES_ERJ2RKF75R0X]
T4  10dB Dir Coupler  [PSON65P164X204X84-6N]
T6  BD0810J50100AHF  [BD0810J50100AHF]
U6  PE64906MLAA-Z  [QFN50P200X200X60-11N]
U7  PE64906MLAA-Z  [QFN50P200X200X60-11N]
U8  PE64906MLAA-Z  [QFN50P200X200X60-11N]

### Ports
Carrier_Cancellation (harness Carrier_Cancellation, see System Overview[3A], External interfaces and connections[1A], Microcontroller[4B]), RX_D (harness RX_D, see System Overview[3A], UHF RFID READER IC[1D]), SPI (bidir, harness SPI, see System Overview[3A], External interfaces and connections[1A], Microcontroller[4A], UHF RFID READER IC[1A]), TX (in, see System Overview[3A], External Power Amplifier[4B]), TX_RX (see System Overview[3A], Antenna Switch[3B])

### Harnesses
SPI: CLK, MISO, MOSI
Carrier_Cancellation: ETC_1, ETC_2, ETC_3
RX_D: RX_N, RX_P

### Nets
3V3: C18.2 C19.2 C53.2 C68.2 C87.2 C95.2 U6.4(VDD) U7.4(VDD) U8.4(VDD)
GND: C18.1 C19.1 C53.1 C68.1 C87.1 C95.1 J3.G1 J3.G2 L11.1 L12.1 R26.1 R35.1 T4.3(GND@1) T4.4(GND@2) T6.2(GND2) T6.5(GND5) U6.3(GND) U6.8(RF+) U6.9(RF+) U6.10(GND) U6.11(GND) U7.3(GND) U7.10(GND) U7.11(GND) U8.3(GND) U8.8(RF+) U8.9(RF+) U8.10(GND) U8.11(GND)
CLK: U6.5(SCL) U7.5(SCL) U8.5(SCL) ; port SPI.CLK
ETC_1: U6.6(SEN) ; port Carrier_Cancellation.ETC_1
ETC_2: U7.6(SEN) ; port Carrier_Cancellation.ETC_2
ETC_3: U8.6(SEN) ; port Carrier_Cancellation.ETC_3
MOSI: U6.7(SDA) U7.7(SDA) U8.7(SDA) ; port SPI.MOSI
RX_N: T6.3(B1) ; port RX_D.RX_N
RX_P: T6.4(B2) ; port RX_D.RX_P
NetC37_1: C37.1 L11.2 T4.2(ISO/COUP@1) U6.1(RF-) U6.2(RF-) U7.1(RF-) U7.2(RF-)
NetC37_2: C37.2 R34.1
NetC112_2: T4.6(DIR/IN@2) ; port TX_RX
NetJ3_A: J3.A T4.5(ISO/COUP@2)
NetJ3_C: J3.C T6.1(UB)
NetL12_2: L12.2 R26.2 R34.2 R35.2 U7.8(RF+) U7.9(RF+) U8.1(RF-) U8.2(RF-)
NetT2_1: T4.1(DIR/IN@1) ; port TX

Not connected (* = marked no-connect by the designer): T6 6(NC)*

### Layout directives
net class RF_50: NetC37_1, NetC37_2, NetJ3_A, NetJ3_C, NetL12_2, NetT2_1

### Notes on the sheet
- Carrier Cancellation Circuit

### Library data of the parts
C18 C19 C87 = GRM033R60J225ME15D: as C13 on sheet UHF RFID READER IC; Package: None; Price: None; Value: *; MP: GRM033R60J225ME15D; Availability: Unavailable
C37 = GRM1555C1H3R6BA01D: SMD Capacitor C0G(EIA) with Capacitance: 3.6pF Tol. 0.1pF. Rated Voltage: 50Vdc; MF: Murata Electronics; MP: GRM1555C1H3R6BA01D; Availability: Warning; Price: None; SnapEDA_Link: https://www.snapeda.com/parts/GRM1555C1H3R6BA01D/Murata%20Electronics%20North%20America/view-part/1837607/?ref=snap; Purchase-URL: https://pricing.snapeda.com/search/part/GRM1555C1H3R6BA01D/?ref=eda; Value: *; Package: 1005 Taiyo Yuden
C53 C68 C95 = GRM0335C1H121JA01D: as C12 on sheet UHF RFID READER IC; Check_prices: https://www.snapeda.com/parts/GRM0335C1H121JA01D/Murata%20Electronics%20North%20America/view-part/1767262/?ref=eda; Value: *; Purchase-URL: https://pricing.snapeda.com/search/part/GRM0335C1H121JA01D/?ref=eda; Package: 0603 Taiyo Yuden; Price: None; MP: GRM0335C1H121JA01D; Availability: In Stock; SnapEDA_Link: https://www.snapeda.com/parts/GRM0335C1H121JA01D/Murata%20Electronics%20North%20America/view-part/1767262/?ref=snap
J3 = MS-156HF(01): as J9 on sheet UHF RFID READER IC; Package: None; MP: MS-156HF(01); Value: *; SnapEDA_Link: https://www.snapeda.com/parts/MS-156HF(01)/Hirose%20Electric%20Co%20Ltd/view-part/1243878/?ref=snap; Price: None; Availability: Unavailable
L11 = LQW15AN6N8G00D: Inductor with Inductance: 6.8nH Tol. +/-2%, Package: 0402 (1005); MF: Murata; Package: 1006 Murata; DigiKey-Purchase-URL: https://snapeda.com/shop?store=DigiKey&id=555756; MP: LQW15AN6N8G00D; Mouser-Purchase-URL: https://snapeda.com/shop?store=Mouser&id=555756; Price: None; Availability: Good; Arrow_Electronics-Purchase-URL: https://snapeda.com/shop?store=Arrow+Electronics&id=555756; Value: *; SnapEDA_Link: https://www.snapeda.com/parts/LQW15AN6N8G00D/Murata%20Electronics%20North%20America/view-part/555756/?ref=snap
L12 = LQW15AN5N6C10D: Ind RF Chip Wirewound 5.6nH 0.2nH 100MHz 30Q-Factor 800mA 0402 Paper T/R; Package: None; Price: None; Value: *; MP: LQW15AN5N6C10D; Availability: Unavailable
R26 R35 = ERJ2RKF75R0X: Availability: Unavailable; Value: *; Package: None; Price: None; MP: ERJ2RKF75R0X
R34 = RC0402JR-070RL: MF: {'manufacturer': u'YAGEO'}; Package: None; Price: None; Value: *; MP: RC0402JR-070RL; Availability: Unavailable
T4 = DC0710J5010AHF: RF Directional Coupler General Purpose 700MHz ~ 1GHz 10.9dB 2W 0805 (2012 Metric); MF: Anaren; SnapEDA_Link: https://www.snapeda.com/parts/DC0710J5010AHF/Anaren/view-part/480146/?ref=snap; Value: *; Price: None; Availability: Good; Mouser-Purchase-URL: https://snapeda.com/shop?store=Mouser&id=480146; MP: DC0710J5010AHF; Package: 0805 Anaren Microwave; DigiKey-Purchase-URL: https://snapeda.com/shop?store=DigiKey&id=480146
T6 = BD0810J50100AHF: as T5 on sheet UHF RFID READER IC; SnapEDA_Link: https://www.snapeda.com/parts/BD0810J50100AHF/LM+Technologies/view-part/?ref=snap; Package: None; Value: *; MP: BD0810J50100AHF; Check_prices: https://www.snapeda.com/parts/BD0810J50100AHF/LM+Technologies/view-part/?ref=eda
U6-U8 = PE64906MLAA-Z: Murata Digitally Tunable Capacitor (100-3000 MHz) 0.9-4.6pF, SPI Interface; MF: pSemi; MP: PE64906MLAA-Z; Availability: Bad; SnapEDA_Link: https://www.snapeda.com/parts/PE64906MLAA-Z/pSemi/view-part/4991719/?ref=snap; Package: None; Price: None; Value: *

## Sheet USB suply_UART bridge.SchDoc
size A4; SheetNumber: 7; SheetTotal: 10
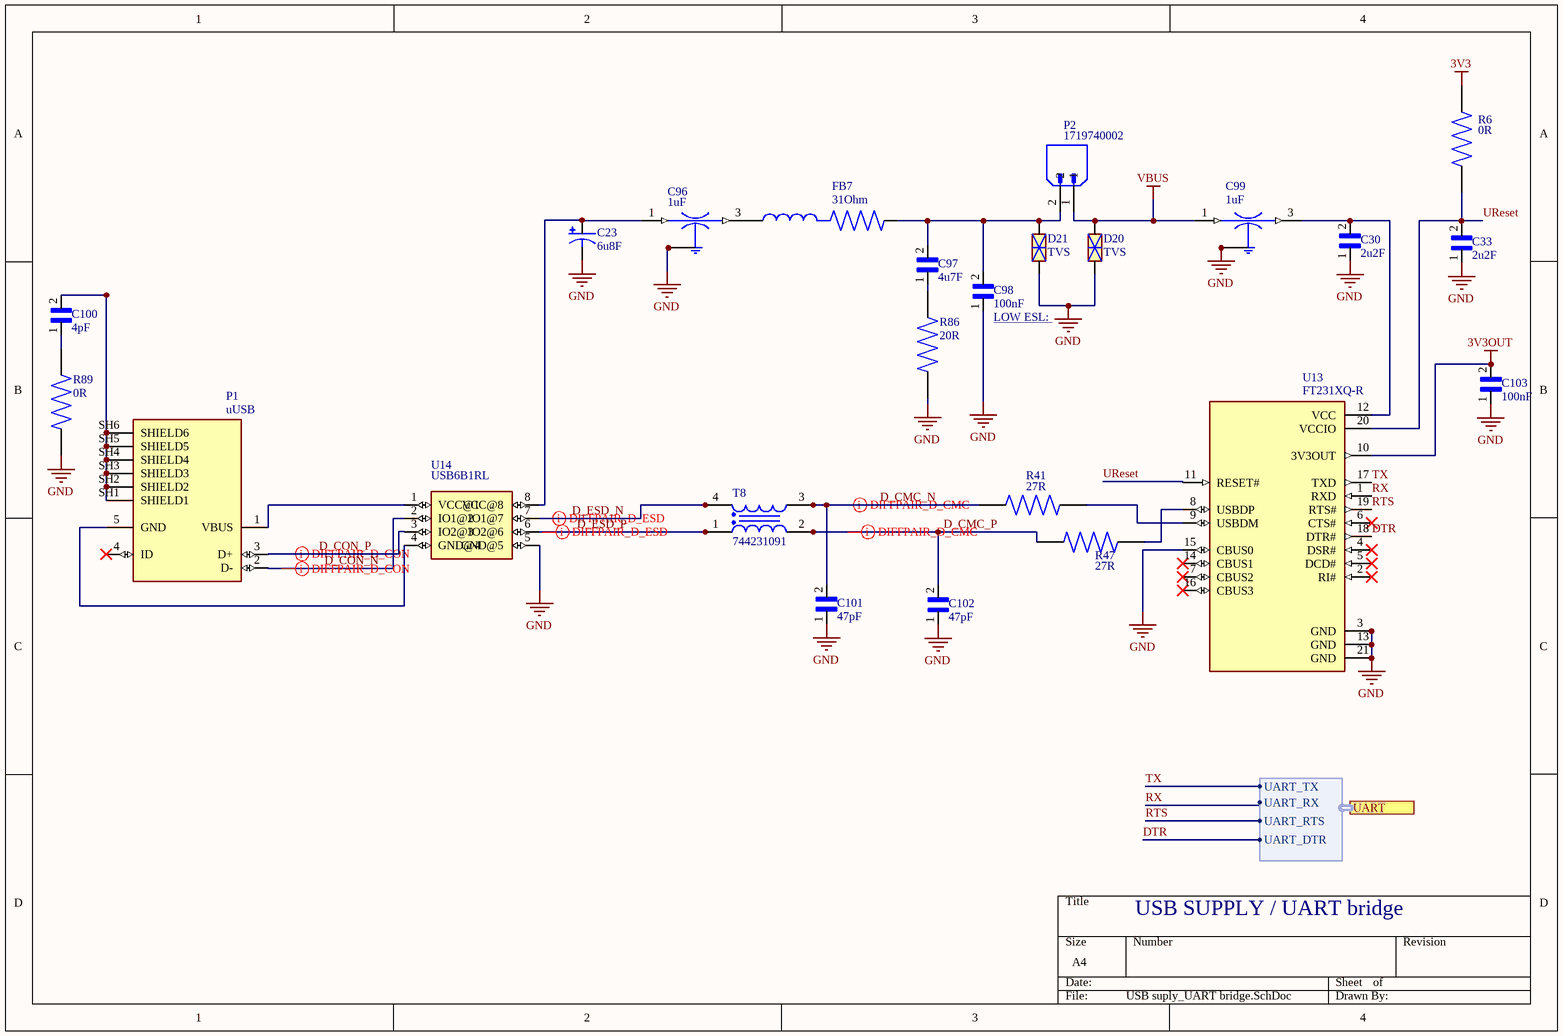
[diagram p5: USB suply_UART bridge.SchDoc]

### Parts
C23  6u8F  [2917(POL)]
C30  2u2F  [CAPC0603X35N]
C33  2u2F  [CAPC0603X35N]
C96  1uF  [FIL_NFM21PC105B1A3D]
C97  4u7F  [CAPC1608X100N]
C98  100nF  [CAPC0510X35N]
C99  1uF  [FIL_NFM21PC105B1A3D]
C100  4pF  [CAPC1005X55N]
C101  47pF  [CAPC1005X55N]
C102  47pF  [CAPC1005X55N]
C103  100nF  [CAPC0603X33N]
D20  TVS  [ST0201]
D21  TVS  [ST0201]
FB7  31Ohm  [FIL_NFZ32BW310HN11L]
P1  uUSB  [MOLEX_1050170001]
P2  1719740002  [MOLEX_1719740002]
R6  0R  [RESC1005X37N]
R41  27R  [RESC1005X40N]
R47  27R  [RESC1005X40N]
R86  20R  [RESC1005X40N]
R89  0R  [RESC1005X37N]
T8  744231091  [WE-CNSW_0805]
U13  FT231XQ-R  [QFN50P400X400X80-21N]
U14  USB6B1RL  [SOIC8]

### Ports
UART (harness UART, see System Overview[1B], External interfaces and connections[1C], Microcontroller[1A])

### Harnesses
UART: UART_TX, UART_RX, UART_RTS, UART_DTR

### Nets
3V3: R6.2
3V3OUT: C103.2 U13.10(3V3OUT)
GND: C23.2(NEG) C30.1 C33.1 C96.2(GND) C96.2_1(GND) C96.2_2(GND) C96.2_3(GND) C96.2_4(GND) C98.1 C99.2(GND) C99.2_1(GND) C99.2_2(GND) C99.2_3(GND) C99.2_4(GND) C101.1 C102.1 C103.1 D20.1 D21.1 R86.1 R89.1 U13.3(GND) U13.13(GND) U13.15(CBUS0) U13.21(GND) U14.5(GND@5)
VBUS: C99.1(IN) D20.2 P2.1
D_CMC_N: C101.2 R41.1 T8.3
D_CMC_P: C102.2 R47.1 T8.2
D_CON_N: P1.2(D-) U14.2(IO1@2)
D_CON_P: P1.3(D+) U14.3(IO2@3)
D_ESD_N: T8.4 U14.7(IO1@7)
D_ESD_P: T8.1 U14.6(IO2@6)
DTR: U13.18(DTR#) ; port UART.UART_DTR
RTS: U13.19(RTS#) ; port UART.UART_RTS
RX: U13.1(RXD) ; port UART.UART_RX
TX: U13.17(TXD) ; port UART.UART_TX
UReset: C33.2 R6.1 U13.11(RESET#) U13.20(VCCIO)
NetC23_1: C23.1(POS) C96.1(IN) U14.8(VCC@8)
NetC30_2: C30.2 C99.3(OUT) U13.12(VCC)
NetC96_3: C96.3(OUT) FB7.1
NetC97_1: C97.1 R86.2
NetC97_2: C97.2 C98.2 D21.2 FB7.2 P2.2
NetC100_1: C100.1 R89.2
NetC100_2: C100.2 P1.SH1(SHIELD1) P1.SH2(SHIELD2) P1.SH3(SHIELD3) P1.SH4(SHIELD4) P1.SH5(SHIELD5) P1.SH6(SHIELD6)
NetP1_1: P1.1(VBUS) U14.1(VCC@1)
NetP1_5: P1.5(GND) U14.4(GND@4)
NetR41_2: R41.2 U13.9(USBDM)
NetR47_2: R47.2 U13.8(USBDP)

Not connected (* = marked no-connect by the designer): P1 4(ID)*; U13 2(RI#)* 4(DSR#)* 5(DCD#)* 6(CTS#)* 7(CBUS2)* 14(CBUS1)* 16(CBUS3)*

### Layout directives
differential pair; differential pair class D_CON: D_CON_N, D_CON_P
differential pair; differential pair class D_ESD: D_ESD_N, D_ESD_P
differential pair; differential pair class D_CMC: D_CMC_N, D_CMC_P

### Notes on the sheet
- USB SUPPLY / UART bridge

### Library data of the parts
C23 = ECASD41C685M070K00: 6.8 µF 16 V Aluminum - Polymer Capacitors 2917 (7343 Metric) 70mOhm 1000 Hrs @ 105°C; MF: Murata; SnapEDA_Link: https://www.snapeda.com/parts/ECASD41C685M070K00/Murata/view-part/?ref=snap; Package: 2917 Murata; Value: *; MP: ECASD41C685M070K00; Check_prices: https://www.snapeda.com/parts/ECASD41C685M070K00/Murata/view-part/?ref=eda
C30 C33 = GRM033R60J225ME15D: as C13 on sheet UHF RFID READER IC; Package: None; Price: None; Value: *; MP: GRM033R60J225ME15D; Availability: Unavailable
C96 C99 = NFM21PC105B1A3D: SMD Capacitor with Capacitance: 1.0uF Tol. 20%. Rated Voltage: 10Vdc; MF: Murata; Value: *; Package: NONSTANDARD; Price: None; MP: NFM21PC105B1A3D; Availability: Unavailable; SnapEDA_Link: https://www.snapeda.com/parts/NFM21PC105B1A3D/Murata/view-part/4380627/?ref=snap
C97 = GRM188R61A475KE15D: SMD Capacitor X5R(EIA) with Capacitance: 4.7uF Tol. 10%. Rated Voltage: 10Vdc; MF: Murata; MP: GRM188R61A475KE15D; Value: *; Availability: Bad; Package: 1608 Murata; SnapEDA_Link: https://www.snapeda.com/parts/GRM188R61A475KE15D/Murata%20Electronics%20North%20America/view-part/523427/?ref=snap; Price: None
C98 = LLL153C80J104ME01E: as C67 on sheet UHF RFID READER IC; Price: None; Value: *; Purchase-URL: https://pricing.snapeda.com/search/part/LLL153C80J104ME01E/?ref=eda; Package: 0510 Murata; SnapEDA_Link: https://www.snapeda.com/parts/LLL153C80J104ME01E/Murata/view-part/4376162/?ref=snap; Availability: Good; MP: LLL153C80J104ME01E
C100 = GRM1555C1H4R0CA01D: Cap Ceramic 4pF 50V C0G 0.25pF SMD 0402 125Â°C Paper T/R; Package: None; Price: None; Value: *; MP: GRM1555C1H4R0CA01D; Availability: Unavailable
C101 C102 = GRM1555C1H470FA01D: CAP, MLCC, C0G, 47PF, 50V, 0402; Package: None; Price: None; Value: *; MP: GRM1555C1H470FA01D; Availability: Unavailable
C103 = GRM033C80J104KE15D: SMD capacitor X6S(EIA) with capacitance 0.10uF Tol.10%. Rated voltage 6.3Vdc 105C; MF: Murata Electronics; Availability: In Stock; SnapEDA_Link: https://www.snapeda.com/parts/GRM033C80J104KE15D/Murata+Electronics+North+America/view-part/?ref=snap; Price: None; Check_prices: https://www.snapeda.com/parts/GRM033C80J104KE15D/Murata+Electronics+North+America/view-part/?ref=eda; Package: 0603 Taiyo Yuden; Purchase-URL: https://pricing.snapeda.com/search/part/GRM033C80J104KE15D/?ref=eda; MP: GRM033C80J104KE15D; Value: *
D20 D21 = ESDAXLC6-1BU2: 17V Clamp 1A (8/20Âµs) Ipp Tvs Diode Surface Mount ST0201; MF: STMicroelectronics; SnapEDA_Link: https://www.snapeda.com/parts/ESDAXLC6-1BU2/STMicroelectronics/view-part/?ref=snap; Package: 0201 STMicroelectronics; Value: *; MP: ESDAXLC6-1BU2; Check_prices: https://www.snapeda.com/parts/ESDAXLC6-1BU2/STMicroelectronics/view-part/?ref=eda
FB7 = NFZ32BW310HN11L: 31 Ohms @ 1MHz 1 Ferrite Bead 2-SMD, Flat Lead 1.2A 186mOhm; MF: Murata; Availability: Warning; MP: NFZ32BW310HN11L; Price: None; Value: *; SnapEDA_Link: https://www.snapeda.com/parts/NFZ32BW310HN11L/Murata/view-part/2726849/?ref=snap; Purchase-URL: https://pricing.snapeda.com/search/part/NFZ32BW310HN11L/?ref=eda; Package: SMD-2 Murata
P1 = 1050170001: USB - micro B USB 2.0 Receptacle Connector 5 Position Surface Mount, Right Angle; Through Hole; MF: Molex; SnapEDA_Link: https://www.snapeda.com/parts/1050170001/Molex/view-part/?ref=snap; Package: None; Value: *; MP: 1050170001; Check_prices: https://www.snapeda.com/parts/1050170001/Molex/view-part/?ref=eda
P2 = 1719740002: 2.54mm Pitch SL Header, Single Row, Right-Angle, LCP, Shrouded, Through Hole, Matte Tin (Sn) Plating, 2 Circuits; Availability: Unavailable; Price: None; Package: None; Value: *; MP: 1719740002
R6 R89 = RC0402JR-070RL: MF: {'manufacturer': u'YAGEO'}; Package: None; Price: None; Value: *; MP: RC0402JR-070RL; Availability: Unavailable
R41 R47 = RC0402FR-0727RL: Surface Mount Thick Film Resistor, RC Series, 27 ohm, 63 mW, - 1%, 50 V, 0402 [1005 Metric]; MF: Yageo; Digi-Key_Purchase_URL: https://www.digikey.com/product-detail/en/yageo/RC0402FR-0727RL/YAG3086CT-ND/5281951?utm_source=snapeda&utm_medium=aggregator&utm_campaign=symbol; Digi-Key_Part_Number: YAG3086CT-ND; Package: 1005 Panasonic Electronic Components; SnapEDA_Link: https://www.snapeda.com/parts/RC0402FR-0727RL/Yageo/view-part/938293/?ref=snap; MP: RC0402FR-0727RL; Value: *
R86 = RC0402JR-0720RL: 20 Ohms ±5% 0.063W, 1/16W Chip Resistor 0402 (1005 Metric) Moisture Resistant Thick Film; MF: Yageo; SnapEDA_Link: https://www.snapeda.com/parts/RC0402JR-0720RL/Yageo/view-part/?ref=snap; Package: 1005 Panasonic Electronic Components; Value: *; MP: RC0402JR-0720RL; Check_prices: https://www.snapeda.com/parts/RC0402JR-0720RL/Yageo/view-part/?ref=eda
T8 = CMP-0222-00046-2: NexarPartId: 22803305; Voltage Rating: 50V; Current Rating: 370mA; Test Frequency: 100MHz; Resistance: 300mΩ; Inductance: 131nH; Number of Lines: 2; Core Material: Ferrite; Impedance: 90Ω; Tolerance: 25%; Length: 2mm; Width: 1.2mm; Mount: Surface Mount; Ambient Temperature Range Low: -40°C; Current: 370mA; Voltage Rating (DC): 50V; DC Resistance (DCR): 300mΩ; Frequency: 100MHz; Voltage Rating (AC): 50V; Lead Free: Lead Free; Height: 1.2mm; Depth: 1.2mm; RoHS: Compliant; Termination: SMD/SMT; Number of Pins: 4; Case/Package: 0805; Min Operating Temperature: -40°C; Weight: 11.991848mg; Max Current Rating: 370mA; REACH SVHC: No SVHC; Packaging: Digi-Reel®; Max DC Current: 370mA; Ambient Temperature Range High: 85°C; Max Operating Temperature: 125°C
U13 = FT231XQ-R: USB2.0 Full Speed IC offers a compact bridge to full handshake UART Interface; Package: None; Price: None; Availability: Unavailable; MP: FT231XQ-R; Value: *
U14 = USB6B1RL: - Clamp - Ipp Tvs Diode Surface Mount 8-SOIC; MF: STMicroelectronics; SnapEDA_Link: https://www.snapeda.com/parts/USB6B1RL/STMicroelectronics/view-part/?ref=snap; Package: SOIC-8 STMicroelectronics; Value: *; MP: USB6B1RL; Check_prices: https://www.snapeda.com/parts/USB6B1RL/STMicroelectronics/view-part/?ref=eda